# Altium project Main.PrjPCB
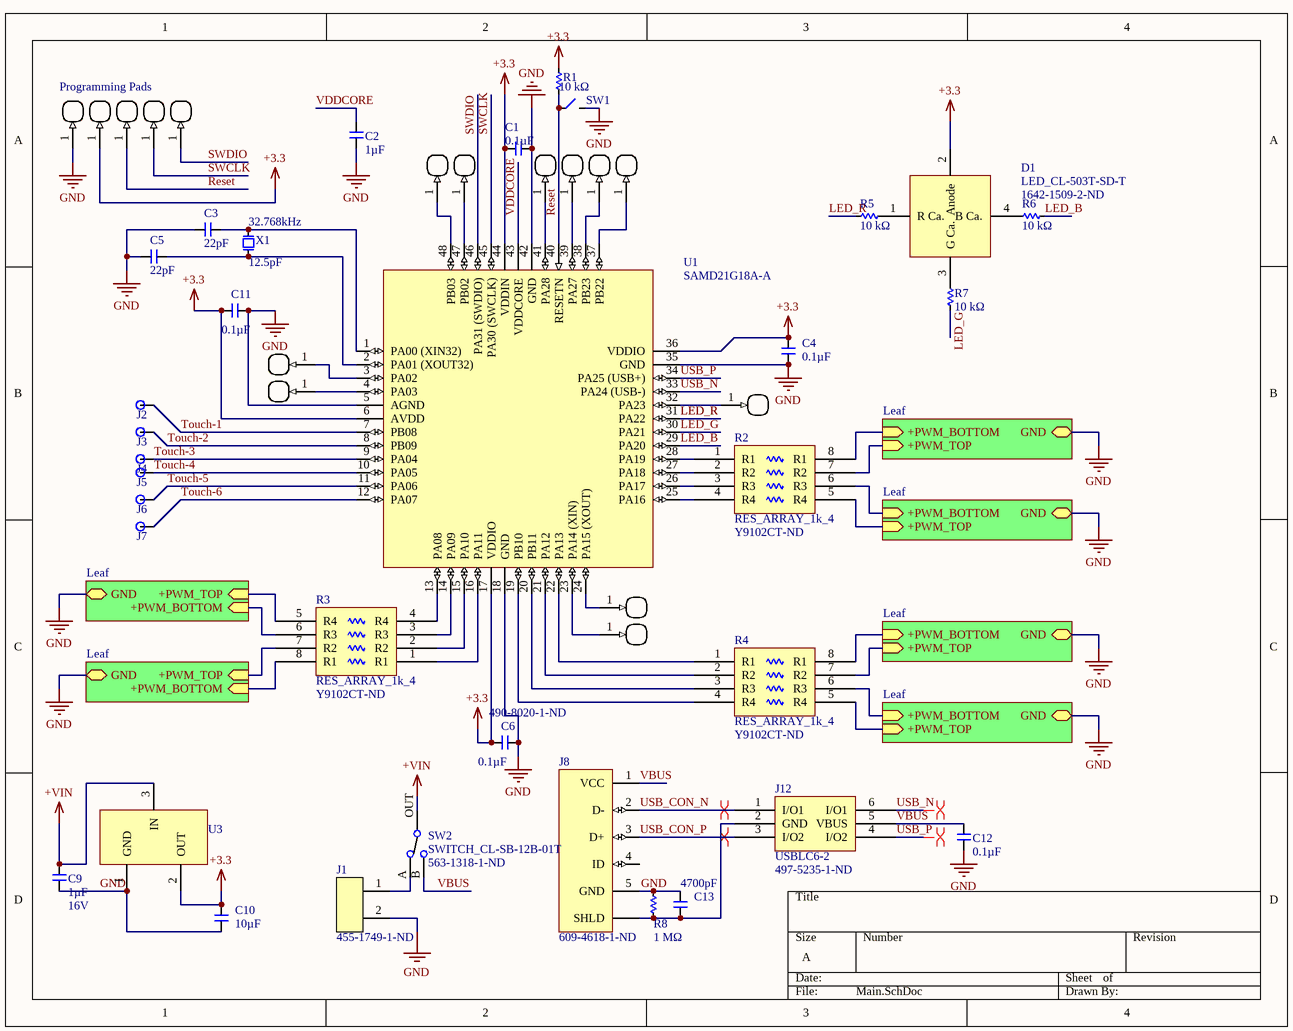
[diagram p0: Main.SchDoc]
3 sheets, 197 parts. Net scope: hierarchical (ports join the sheet entries above them; power ports are global).
Board file: Main_New.PcbDoc
Sheets:
  Main.SchDoc
    L1 = Leaf.SchDoc
    L1 = Leaf.SchDoc
    L1 = Leaf.SchDoc
    L1 = Leaf.SchDoc
    L1 = Leaf.SchDoc
    L1 = Leaf.SchDoc
  BMP388.SchDoc

## Sheet Main.SchDoc
size A

### Parts
C1  Capacitance (shorthand): 0.1µF  [C0603]  (hidden comment: __template_cap)
C2  Capacitance (shorthand): 1µF  [C0603]  (hidden comment: __template_cap)
C3  Capacitance (shorthand): 22pF  [C0603]  (hidden comment: __template_cap)
C4  Capacitance (shorthand): 0.1µF  [C0603]  (hidden comment: __template_cap)
C5  Capacitance (shorthand): 22pF  [C0603]  (hidden comment: __template_cap)
C6  Capacitance (shorthand): 0.1µF  Supplier Part Number 2: 490-8020-1-ND  [C0603]  (hidden comment: __template_cap)
C9  Capacitance (shorthand): 1µF  Rated Voltage: 16V  [C0603]  (hidden comment: __template_cap)
C10  Capacitance (shorthand): 10µF  [C0603]  (hidden comment: __template_cap)
C11  Capacitance (shorthand): 0.1µF  [C0603]  (hidden comment: __template_cap)
C12  Capacitance (shorthand): 0.1µF  [C0603]  (hidden comment: __template_cap)
C13  Capacitance (shorthand): 4700pF  [C0603]  (hidden comment: __template_cap)
D1  LED_CL-503T-SD-T  Supplier Part Number 1: 1642-1509-2-ND  [LED_RGB_CL-503T-SD-T]
J1  Supplier Part Number 1: 455-1749-1-ND  [CONN_JST_PH_SM4_2PIN_RA]  (hidden comment: CONN JST 2POS SMD)
J2  CONN_1x1  [CONN_1x1_100MIL]  (value not drawn)
J3  CONN_1x1  [CONN_1x1_100MIL]  (value not drawn)
J4  CONN_1x1  [CONN_1x1_100MIL]  (value not drawn)
J5  CONN_1x1  [CONN_1x1_100MIL]  (value not drawn)
J6  CONN_1x1  [CONN_1x1_100MIL]  (value not drawn)
J7  CONN_1x1  [CONN_1x1_100MIL]  (value not drawn)
J8  Supplier Part Number 1: 609-4618-1-ND  [CONN_USBMICROB_10118194-0001LF]  (hidden comment: CONN_USB_MICROB_SMD_TH_R/A)
J12  USBLC6-2  Supplier Part Number 1: 497-5235-1-ND  [6SOT23]
PA02  EWOD_PAD  [EWOD-PAD-2MM]  (value not drawn)
PA03  EWOD_PAD  [EWOD-PAD-2MM]  (value not drawn)
PA14  EWOD_PAD  [EWOD-PAD-2MM]  (value not drawn)
PA15  EWOD_PAD  [EWOD-PAD-2MM]  (value not drawn)
PA23  EWOD_PAD  [EWOD-PAD-2MM]  (value not drawn)
PA27  EWOD_PAD  [EWOD-PAD-2MM]  (value not drawn)
PA28  EWOD_PAD  [EWOD-PAD-2MM]  (value not drawn)
PB02  EWOD_PAD  [EWOD-PAD-2MM]  (value not drawn)
PB03  EWOD_PAD  [EWOD-PAD-2MM]  (value not drawn)
PB22  EWOD_PAD  [EWOD-PAD-2MM]  (value not drawn)
PB23  EWOD_PAD  [EWOD-PAD-2MM]  (value not drawn)
PRG_3.3  EWOD_PAD  [EWOD-PAD-2MM]  (value not drawn)
PRG_GND  EWOD_PAD  [EWOD-PAD-2MM]  (value not drawn)
PRG_RST  EWOD_PAD  [EWOD-PAD-2MM]  (value not drawn)
PRG_SWCLK  EWOD_PAD  [EWOD-PAD-2MM]  (value not drawn)
PRG_SWDIO  EWOD_PAD  [EWOD-PAD-2MM]  (value not drawn)
R1  Resistance: 10 kΩ  [R0603]  (hidden comment: __template_resistor)
R2  RES_ARRAY_1k_4  Supplier Part Number 1: Y9102CT-ND  [RES_ARRAY_1k]
R3  RES_ARRAY_1k_4  Supplier Part Number 1: Y9102CT-ND  [RES_ARRAY_1k]
R4  RES_ARRAY_1k_4  Supplier Part Number 1: Y9102CT-ND  [RES_ARRAY_1k]
R5  Resistance: 10 kΩ  [R0603]  (hidden comment: __template_resistor)
R6  Resistance: 10 kΩ  [R0603]  (hidden comment: __template_resistor)
R7  Resistance: 10 kΩ  [R0603]  (hidden comment: __template_resistor)
R8  Resistance: 1 MΩ  [R0603]  (hidden comment: __template_resistor)
SW1  SWITCH_SPST-NO  [SWITCH_B3U-1000P]  (value not drawn)
SW2  SWITCH_CL-SB-12B-01T  Supplier Part Number 1: 563-1318-1-ND  [SWITCH_CL-SB-12B-01T]
U1  SAMD21G18A-A  [SAMD21 TQFP-48]
U3  LDO_AP2210N-3.3TRG1  [3SOT23]  (value not drawn)
X1  Frequency: 32.768kHz  Load Capacitance: 12.5pF  [XTAL_TXC_9HT10]  (hidden comment: XTAL_9HT10-32.768KEZF-T)

### Sub-sheets
L1 = Leaf: GND (bidir), +PWM_TOP (in), +PWM_BOTTOM (in)
L1 = Leaf: GND (bidir), +PWM_TOP (in), +PWM_BOTTOM (in)
L1 = Leaf: GND (bidir), +PWM_TOP (in), +PWM_BOTTOM (in)
L1 = Leaf: GND (bidir), +PWM_TOP (in), +PWM_BOTTOM (in)
L1 = Leaf: GND (bidir), +PWM_TOP (in), +PWM_BOTTOM (in)
L1 = Leaf: GND (bidir), +PWM_TOP (in), +PWM_BOTTOM (in)

### Nets
+3.3: C1.2 C4.2 C6.1 C10.1 C11.1 D1.2(Anode) PRG_3.3.1 R1.2 U1.6(AVDD) U1.17(VDDIO) U1.36(VDDIO) U1.44(VDDIN) U3.2(OUT)
+PWM_BOTTOM: R2.6(R3) R2.8(R1) R3.6(R3) R3.8(R1) R4.6(R3) R4.8(R1) ; sheet L1/+PWM_BOTTOM, sheet L1/+PWM_BOTTOM, sheet L1/+PWM_BOTTOM, sheet L1/+PWM_BOTTOM, sheet L1/+PWM_BOTTOM, sheet L1/+PWM_BOTTOM
+PWM_TOP: R2.5(R4) R2.7(R2) R3.5(R4) R3.7(R2) R4.5(R4) R4.7(R2) ; sheet L1/+PWM_TOP, sheet L1/+PWM_TOP, sheet L1/+PWM_TOP, sheet L1/+PWM_TOP, sheet L1/+PWM_TOP, sheet L1/+PWM_TOP
+VIN: C9.1 SW2.OUT U3.3(IN)
GND: C1.1 C2.2 C3.1 C4.1 C5.1 C6.2 C9.2 C10.2 C11.2 C12.2 C13.1 J1.2 J8.5(GND) PRG_GND.1 R8.2 SW1.2 U1.5(AGND) U1.18(GND) U1.35(GND) U1.42(GND) U3.1(GND) ; sheet L1/GND, sheet L1/GND, sheet L1/GND, sheet L1/GND, sheet L1/GND, sheet L1/GND
LED_B: R6.2 U1.29(PA20)
LED_G: R7.1 U1.30(PA21)
LED_R: R5.2 U1.31(PA22)
Reset: PRG_RST.1 R1.1 SW1.1 U1.40(RESETN)
SWCLK: PRG_SWCLK.1 U1.45(PA30_(SWCLK))
SWDIO: PRG_SWDIO.1 U1.46(PA31_(SWDIO))
Touch-1: J2.1 U1.7(PB08)
Touch-2: J3.1 U1.8(PB09)
Touch-3: J4.1 U1.9(PA04)
Touch-4: J5.1 U1.10(PA05)
Touch-5: J6.1 U1.11(PA06)
Touch-6: J7.1 U1.12(PA07)
USB_CON_N: J8.2(D-) J12.1(I/O1)
USB_CON_P: J8.3(D+) J12.3(I/O2)
USB_N: J12.6(I/O1) U1.33(PA24_(USB-))
USB_P: J12.4(I/O2) U1.34(PA25_(USB+))
VBUS: C12.1 J8.1(VCC) J12.5(VBUS) SW2.B
VDDCORE: C2.1 U1.43(VDDCORE)
NetC3_2: C3.2 U1.1(PA00_(XIN32)) X1.2
NetC5_2: C5.2 U1.2(PA01_(XOUT32)) X1.1
NetC13_2: C13.2 J8.SHIELD(SHLD) J12.2(GND) R8.1
NetD1_1: D1.1(R_Ca.) R5.1
NetD1_3: D1.3(G_Ca.) R7.2
NetD1_4: D1.4(B_Ca.) R6.1
NetJ1_1: J1.1 SW2.A
NetPA02_1: PA02.1 U1.3(PA02)
NetPA03_1: PA03.1 U1.4(PA03)
NetPA14_1: PA14.1 U1.23(PA14_(XIN))
NetPA15_1: PA15.1 U1.24(PA15_(XOUT))
NetPA23_1: PA23.1 U1.32(PA23)
NetPA27_1: PA27.1 U1.39(PA27)
NetPA28_1: PA28.1 U1.41(PA28)
NetPB02_1: PB02.1 U1.47(PB02)
NetPB03_1: PB03.1 U1.48(PB03)
NetPB22_1: PB22.1 U1.37(PB22)
NetPB23_1: PB23.1 U1.38(PB23)
NetR2_1: R2.1(R1) U1.28(PA19)
NetR2_2: R2.2(R2) U1.27(PA18)
NetR2_3: R2.3(R3) U1.26(PA17)
NetR2_4: R2.4(R4) U1.25(PA16)
NetR3_1: R3.1(R1) U1.16(PA11)
NetR3_2: R3.2(R2) U1.15(PA10)
NetR3_3: R3.3(R3) U1.14(PA09)
NetR3_4: R3.4(R4) U1.13(PA08)
NetR4_1: R4.1(R1) U1.22(PA13)
NetR4_2: R4.2(R2) U1.21(PA12)
NetR4_3: R4.3(R3) U1.20(PB11)
NetR4_4: R4.4(R4) U1.19(PB10)

Not connected (* = marked no-connect by the designer): J8 4(ID)

### Layout directives
differential pair: USB_CON_N, USB_CON_P, USB_N, USB_P

### Notes on the sheet
- Programming Pads

### Library data of the parts
C1 C4 C6 C11 C12 = CAP CER 0603 0.1µF X7R 50V 10%: Manufacturer: Murata Electronics North America; Capacitance - pF (Machine readable): 100000; type: capacitor; Dielectric: X7R; Supplier 1: Digikey
  C1 C4 C11: Supplier Part Number 1: 478-5052-1-ND; Supplier 2: Digi-Key; Supplier Part Number 2: 490-8020-1-ND
  C6: Supplier Part Number 1: 478-5052-1-ND; Supplier 2: Digi-Key
  C12: Supplier Part Number 1: 490-1519-1-ND
C2 = CAP CER 0603 1µF X7R 16V 10%: Manufacturer: Murata Electronics North America; Capacitance - pF (Machine readable): 1000000; TYPE: Capacitor; Dielectric: X7R; Supplier 1: Digi-Key; Supplier Part Number 1: 490-10479-1-ND
C3 C5 = CAP CER 22PF 50V C0G/NP0 0603: Supplier 1: Digi-Key; Supplier Part Number 1: 478-5771-1-ND
C9 = CAP CER 0603 1µF X7R 16V 10%: Manufacturer: Murata Electronics North America; Capacitance - pF (Machine readable): 1000000; type: capacitor; Dielectric: X7R; Supplier 1: Digikey; Supplier Part Number 1: 490-3900-1-ND
C10 = CAP CER 10UF 35V X5R 0603 20%: Manufacturer: Murata Electronics North America; Capacitance - pF (Machine readable): 10000000; type: capacitor; Dielectric: X5R; Supplier 1: Digikey; Supplier Part Number 1: 490-13248-1-ND
C13 = CAP CER 0603 4700pF X7R 50V 10%: Manufacturer: Murata Electronics North America; Capacitance - pF (Machine readable): 4700; type: capacitor; Dielectric: X7R; Supplier 1: Digikey; Supplier Part Number 1: 490-1506-1-ND
D1 = LED_CL-503T-SD-T: RGB LOW VOLTAGE RICOLOR TOP FIRING 1.5 X 1.3 X; Manufacturer: Citizen; Color: Red, Green, Blue (RGB); Configuration: Common Anode; Millicandela Rating: 36mcd Red, 180mcd Green, 40mcd Blue; Lens Style/Size: Rectangle with Flat Top, 1.30mm x 1.50mm; Voltage - Forward (Vf) (Typ): 1.85V Red, 2.7V Green, 2.75V Blue; Current - Test: 5mA Red, 5mA Green, 5mA Blue; Wavelength - Peak: 618nm Red, 530nm Green, 470nm Blue; Supplier 1: Digi-Key; Manufacturer Part Number: CL-503T-SD-T; RoHS: RoHS Compliant; Category: Optoelectronics; Stock 1: 15000; Pricing 1: 5000=0.2318, 10000=0.22836, 25000=0.22321 (USD); Packaging: Tape & Reel (TR); Part Status: Active; Lens Color: -; Lens Transparency: -; Viewing Angle: -; Mounting Type: Surface Mount; Wavelength - Dominant: -; Features: -; Package / Case: 4-SMD, No Lead; Supplier Device Package: -; Size / Dimension: 1.50mm L x 1.30mm W; Height (Max): 0.35mm; ComponentLink1URL: http://ce.citizen.co.jp/up_img/product/KF9Gun57LXzH/CL-503_e.pdf; ComponentLink1Description: http://ce.citizen.co.jp/up_img/product/KF9Gun57LXzH/CL-503_e.pdf
J1 = CONN_JST_2_PH: CONN HEADER PH SIDE 2POS 2MM SMD; Manufacturer: JST Sales America Inc.; Manufacturer Part Number: S2B-PH-SM4-TB(LF)(SN); Connector Type: Header, Shrouded; Number of Positions: 2; Number of Positions Loaded: All; Pitch: 0.079" (2.00mm); Supplier 1: Digi-Key; RoHS: RoHS Compliant; Category: Connectors, Interconnects; Stock 1: 148568; Pricing 1: 1=0.56, 10=0.521, 25=0.4688, 50=0.4168, 100=0.3994, 250=0.36472, 500=0.34734 (USD); Packaging: Cut Tape (CT); Contact Type: Male Pin; Number of Rows: 1; Row Spacing: -; Contact Mating Length: 0.130" (3.30mm); Mounting Type: Surface Mount, Right Angle; Termination: Solder; Fastening Type: Detent Lock; Features: Solder Retention; Contact Finish: Tin; Contact Finish Thickness: -; Color: Natural; ComponentLink1URL: http://www.jst-mfg.com/product/pdf/eng/ePH.pdf; ComponentLink1Description: http://www.jst-mfg.com/product/pdf/eng/ePH.pdf
J2-J7 = CONN_1x1: Just a hole, lol
J8 = CONN_USB_MICROB_SMD_TH_R/A: Through Hole Micro USB Connector; Manufacturer: Amphenol FCI; Manufacturer Part Number: 10118194-0001LF; Gender: Receptacle; Current Rating: 1.8A; Connector Type: USB,Receptacle; Number of Contacts: 5; Insulation Resistance: 1GR; Number of Ports: 1; Max Voltage Rating (AC): 100V; Pitch: 0.65mm; Supplier 1: Digi-Key; Stock 1: 180464; Pricing 1: 1=0.46, 10=0.437, 25=0.3744, 50=0.318, 100=0.3056, 250=0.2744, 500=0.262 (USD); Mount: Surface Mount,Horizontal; Contact Material: Copper Alloy; Contact Plating: Nickel,Gold; Number of Terminals: 5; Housing Material: Polymer; Colour: Black; Min Operating Temperature: -55°C; Max Operating Temperature: 85°C; Package Quantity: 9600; Packaging: Tape and Reel; Termination: Solder; Orientation: Right Angle; Length: 8.05mm; Depth: 5mm; Radiation Hardening: No; Lead Free: Lead Free; Flammability Rating: UL94 V-0; ComponentLink1URL: https://datasheet.ciiva.com/851/10118194-851110.pdf; ComponentLink1Description: https://datasheet.ciiva.com/851/10118194-851110.pdf; ComponentLink2URL: https://datasheet.ciiva.com/851/10118194-851111.pdf; ComponentLink2Description: https://datasheet.ciiva.com/851/10118194-851111.pdf; ComponentLink3URL: https://datasheet.ciiva.com/4598/10118194ac-197217-4598807.pdf; ComponentLink3Description: https://datasheet.ciiva.com/4598/10118194ac-197217-4598807.pdf; ComponentLink4URL: https://datasheet.ciiva.com/29907/10118194-29907230.pdf; ComponentLink4Description: https://datasheet.ciiva.com/29907/10118194-29907230.pdf; ComponentLink5URL: https://datasheet.ciiva.com/26945/getdatasheetpartid-418619-26945695.pdf; ComponentLink5Description: https://datasheet.ciiva.com/26945/getdatasheetpartid-418619-26945695.pdf
J12 = USBLC6-2: Manufacturer: STMicroelectronics; Manufacturer Part Number: USBLC6-2SC6; Unidirectional Channels: 2; Voltage - Reverse Standoff (Typ): 5.25V; Voltage - Breakdown (Min): 6V; Voltage - Clamping (Max) @ Ipp: 17V; Current - Peak Pulse (10/1000µs): 5A (8/20µs); Power Line Protection: Yes; Supplier 1: Digi-Key; RoHS: RoHS Compliant; Category: Circuit Protection; Stock 1: 31719; Pricing 1: 1=0.51, 10=0.411, 100=0.2802, 500=0.21012, 1000=0.15759 (USD); Packaging: Cut Tape (CT); Part Status: Active; Type: Steering (Rail to Rail); Bidirectional Channels: -; Power - Peak Pulse: -; Applications: Ethernet; Capacitance @ Frequency: -; Operating Temperature: -40°C ~ 125°C (TJ); Mounting Type: Surface Mount; Package / Case: SOT-23-6; Supplier Device Package: SOT-23-6; ComponentLink1URL: http://www.st.com/web/en/resource/technical/document/datasheet/CD00050750.pdf; ComponentLink1Description: http://www.st.com/web/en/resource/technical/document/datasheet/CD00050750.pdf
R1 R5-R7 = RES SMD 10K OHM 1% 1/10W 0603: Manufacturer Part Number: RC0603FR-0710KL; Manufacturer: Yageo; Resistance (Sortable): 10000; Tolerance: ±1%; Power (Watts): 0.1W, 1/10W; Temperature Coefficient: ±100ppm/°C; Supplier 1: Digikey; Datasheets: http://www.yageo.com/documents/recent/PYu-RC_Group_51_RoHS_L_9.pdf; Image: //media.digikey.com/Renders/Yageo%20Renders/0603-(1608-Metric).jpg; Operating Temperature: -55°C ~ 155°C
  R1: Supplier Part Number 1: 541-1784-1-ND
  R5-R7: Supplier Part Number 1: 311-10.0KHRCT-ND
R2-R4 = RES_ARRAY_1k_4: RES ARRAY 4 RES 1K OHM 1206; Supplier 1: Digi-Key
R8 = RES SMD 1M OHM 1% 1/10W 0603: Manufacturer Part Number: RC0603FR-071ML; Manufacturer: Yageo; Resistance (Sortable): 1000000; Tolerance: ±1%; Power (Watts): 0.1W, 1/10W; Temperature Coefficient: ±100ppm/°C; Supplier 1: Digikey; Datasheets: http://www.yageo.com/documents/recent/PYu-RC_Group_51_RoHS_L_9.pdf; Image: //media.digikey.com/Renders/Yageo%20Renders/0603-(1608-Metric).jpg; Supplier Part Number 1: 311-1.00MHRCT-ND; Operating Temperature: -55°C ~ 155°C
SW1 = SWITCH_SPST-NO: SWITCH TACTILE SPST-NO 0.05A 12V; Manufacturer: Omron Electronics Inc-EMC Div; Manufacturer Part Number: B3U-1000P; Switch Function: Off-Mom; Actuator Type: Standard; Actuator Height off PCB, from Pins: 1.60mm; Actuator Orientation: Top Actuated; Outline: 3.00mm x 2.50mm; Illumination: Non-Illuminated; Operating Force: 153gf; Ingress Protection: Dust Proof; Switch Travel: 0.15mm; Mechanical Life: 200,000 Cycles; Contact Rating @ Voltage: 0.05A @ 12VDC; Supplier 1: Digi-Key; RoHS: RoHS Compliant; Category: Switches; Stock 1: 16437; Pricing 1: 1=1.25, 10=1.201, 25=1.1332, 50=0.997, 100=0.9064, 250=0.86108, 500=0.83842, 1000=0.65714 (USD); Circuit: SPST-NO; Mounting Type: Surface Mount; Termination Style: SMD (SMT) Tab; Illumination Voltage (Nominal): -; Illumination Type, Color: -; Features: -; Packaging: Cut Tape (CT); Actuator Material: -; Operating Temperature: -25°C ~ 70°C; ComponentLink1URL: http://components.omron.com/components/web/pdflib.nsf/0/2DD3893C7DD33E9E862572900079E9D6/$file/B3U_1110.pdf; ComponentLink1Description: http://components.omron.com/components/web/pdflib.nsf/0/2DD3893C7DD33E9E862572900079E9D6/$file/B3U_1110.pdf; Supplier Part Number 1: SW1020CT-ND
SW2 = SWITCH_CL-SB-12B-01T: Manufacturer: Copal Electronics Inc.; Circuit: SPDT; Contact Timing: Non-Shorting (BBM); Switch Function: On-On; Current Rating: 200mA (DC); Voltage Rating - DC: 12V; Actuator Type: Standard; Actuator Length: 2.00mm; Actuator Material: Polyamide (PA), Nylon; Electrical Life: 10,000 Cycles; Operating Force: 153gf; Supplier 1: Digi-Key; Manufacturer Part Number: CL-SB-12B-01T; RoHS: RoHS Compliant; Category: Switches; Stock 1: 24034; Pricing 1: 1=0.89, 10=0.853, 25=0.8356, 50=0.7466, 100=0.711, 250=0.69328 (USD); Packaging: Cut Tape (CT); Part Status: Active; Voltage Rating - AC: -; Contact Material: Copper; Contact Finish: Silver; Mounting Type: Surface Mount; Termination Style: Gull Wing; Features: -; Switch Travel: 2.00mm; Operating Temperature: -40°C ~ 85°C; Mechanical Life: -; ComponentLink1URL: http://www.nidec-copal-electronics.com/e/catalog/switch/cl-sb.pdf; ComponentLink1Description: http://www.nidec-copal-electronics.com/e/catalog/switch/cl-sb.pdf
U1 = SAMD21G18A-A: 48Mhz Atmel SAM ARM Cortex M0+; ComponentLink1Description: Product Page; ComponentLink1URL: https://www.microchip.com/wwwproducts/en/ATSAMD21G18; ComponentLink2Description: Datasheet; ComponentLink2URL: http://ww1.microchip.com/downloads/en/DeviceDoc/SAM-D21-Family-Datasheet-DS40001882C.pdf; Supplier 1: Digi-Key; Supplier Part Number 1: ATSAMD21G18A-AU-ND
U3 = LDO_AP2210N-3.3TRG1: IC REG LINEAR 3.3V 300MA SOT23-3; Manufacturer: Diodes; Dropout Voltage: 250mV; Number of Outputs: 1; Min Input Voltage: 2.5V; Max Input Voltage: 13.2V; Polarity: Positive; Quiescent Current: 150uA; Accuracy: 1%; Power Supply Rejection Ratio (PSRR): 75dB; Supplier 1: Digi-Key; Manufacturer Part Number: AP2210N-3.3TRG1; Stock 1: 36056; Pricing 1: 1=0.42, 10=0.317, 100=0.1973, 500=0.135, 1000=0.1038 (USD); Mount: Surface Mount; Case/Package: TO-236-3; Number of Pins: 3; Weight: 0.000282oz; Min Operating Temperature: -40°C; Max Operating Temperature: 125°C; Package Quantity: 3000; Packaging: Tape and Reel; Max Output Current: 300mA; Output Voltage: 3.3V; Output Current: 300mA; Number of Regulators: 1; Length: 3.02mm; Height: 1.3mm; Width: 1.7mm; ComponentLink1URL: https://datasheet.ciiva.com/29569/ap2210-29569040.pdf; ComponentLink1Description: https://datasheet.ciiva.com/29569/ap2210-29569040.pdf; Supplier Part Number 1: AP2210N-3.3TRG1DICT-ND
X1 = XTAL_9HT10-32.768KEZF-T: CRYSTAL 32.768 KHZ 12.5 PF SMD; Manufacturer: TXC CORPORATION; Frequency Tolerance: ±10ppm; ESR (Equivalent Series Resistance): 70 kOhm; Operating Mode: Fundamental; Supplier 1: Digi-Key; Manufacturer Part Number: 9HT10-32.768KEZF-T; RoHS: RoHS Compliant; Category: Crystals and Oscillators; Stock 1: 5250; Pricing 1: 1=1.88, 10=1.625, 50=1.425, 100=1.125, 500=0.95, 1000=0.75 (USD); Type: kHz Crystal (Tuning Fork); Frequency Stability: -; Operating Temperature: -40°C ~ 85°C; Ratings: -; Mounting Type: Surface Mount; Package / Case: 2-SMD; Size / Dimension: 0.126" L x 0.059" W (3.20mm x 1.50mm); Height: 0.033" (0.85mm); Packaging: Cut Tape (CT); ComponentLink1URL: http://www.txccrystal.com/images/pdf/9ht10.pdf; ComponentLink1Description: Datasheet; Supplier Part Number 1: 887-1507-1-ND

## Sheet Leaf.SchDoc
size A
Used 6 times, as channels L1, L1, L1, L1, L1, L1. Parts and nets are listed once, with the designators drawn on the sheet.
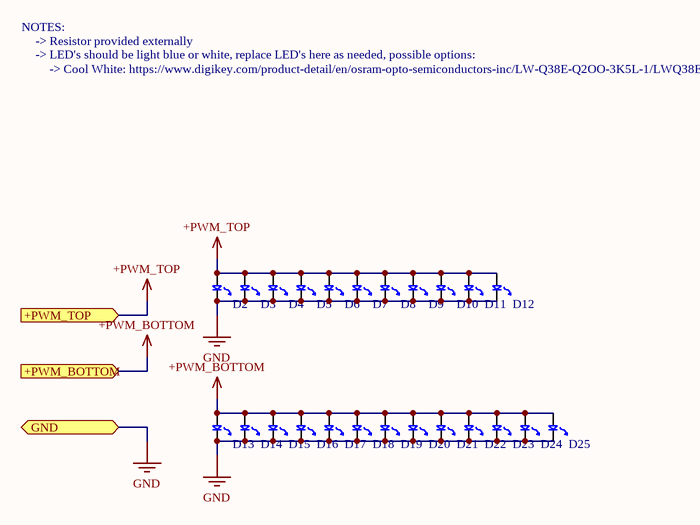
[diagram p1: Leaf.SchDoc]

### Parts
D2  LED_LBQ39G_BLUE  [LED_0603P_BLUE]  (value not drawn)
D3  LED_LBQ39G_BLUE  [LED_0603P_BLUE]  (value not drawn)
D4  LED_LBQ39G_BLUE  [LED_0603P_BLUE]  (value not drawn)
D5  LED_LBQ39G_BLUE  [LED_0603P_BLUE]  (value not drawn)
D6  LED_LBQ39G_BLUE  [LED_0603P_BLUE]  (value not drawn)
D7  LED_LBQ39G_BLUE  [LED_0603P_BLUE]  (value not drawn)
D8  LED_LBQ39G_BLUE  [LED_0603P_BLUE]  (value not drawn)
D9  LED_LBQ39G_BLUE  [LED_0603P_BLUE]  (value not drawn)
D10  LED_LBQ39G_BLUE  [LED_0603P_BLUE]  (value not drawn)
D11  LED_LBQ39G_BLUE  [LED_0603P_BLUE]  (value not drawn)
D12  LED_LBQ39G_BLUE  [LED_0603P_BLUE]  (value not drawn)
D13  LED_LBQ39G_BLUE  [LED_0603P_BLUE]  (value not drawn)
D14  LED_LBQ39G_BLUE  [LED_0603P_BLUE]  (value not drawn)
D15  LED_LBQ39G_BLUE  [LED_0603P_BLUE]  (value not drawn)
D16  LED_LBQ39G_BLUE  [LED_0603P_BLUE]  (value not drawn)
D17  LED_LBQ39G_BLUE  [LED_0603P_BLUE]  (value not drawn)
D18  LED_LBQ39G_BLUE  [LED_0603P_BLUE]  (value not drawn)
D19  LED_LBQ39G_BLUE  [LED_0603P_BLUE]  (value not drawn)
D20  LED_LBQ39G_BLUE  [LED_0603P_BLUE]  (value not drawn)
D21  LED_LBQ39G_BLUE  [LED_0603P_BLUE]  (value not drawn)
D22  LED_LBQ39G_BLUE  [LED_0603P_BLUE]  (value not drawn)
D23  LED_LBQ39G_BLUE  [LED_0603P_BLUE]  (value not drawn)
D24  LED_LBQ39G_BLUE  [LED_0603P_BLUE]  (value not drawn)
D25  LED_LBQ39G_BLUE  [LED_0603P_BLUE]  (value not drawn)

### Ports
+PWM_BOTTOM (in), +PWM_TOP (in), GND (bidir)

### Nets
+PWM_BOTTOM: D13.2 D14.2 D15.2 D16.2 D17.2 D18.2 D19.2 D20.2 D21.2 D22.2 D23.2 D24.2 D25.2 ; port +PWM_BOTTOM
+PWM_TOP: D2.2 D3.2 D4.2 D5.2 D6.2 D7.2 D8.2 D9.2 D10.2 D11.2 D12.2 ; port +PWM_TOP
GND: D2.1 D3.1 D4.1 D5.1 D6.1 D7.1 D8.1 D9.1 D10.1 D11.1 D12.1 D13.1 D14.1 D15.1 D16.1 D17.1 D18.1 D19.1 D20.1 D21.1 D22.1 D23.1 D24.1 D25.1 ; port GND

### Channels
L1: designators end in _L1#1; ports +PWM_BOTTOM=+PWM_BOTTOM +PWM_TOP=+PWM_TOP GND=GND
L1: designators end in _L1#2; ports +PWM_BOTTOM=+PWM_BOTTOM +PWM_TOP=+PWM_TOP GND=GND
L1: designators end in _L1#3; ports +PWM_BOTTOM=+PWM_BOTTOM +PWM_TOP=+PWM_TOP GND=GND
L1: designators end in _L1#4; ports +PWM_BOTTOM=+PWM_BOTTOM +PWM_TOP=+PWM_TOP GND=GND
L1: designators end in _L1#5; ports +PWM_BOTTOM=+PWM_BOTTOM +PWM_TOP=+PWM_TOP GND=GND
L1: designators end in _L1#6; ports +PWM_BOTTOM=+PWM_BOTTOM +PWM_TOP=+PWM_TOP GND=GND

### Notes on the sheet
- NOTES:
- -> Resistor provided externally
- -> LED's should be light blue or white, replace LED's here as needed, possible options:
- -> Cool White: https://www.digikey.com/product-detail/en/osram-opto-semiconductors-inc/LW-Q38E-Q2OO-3K5L-1/LWQ38E-Q2OO-3K5L-1-ND/2205739

### Library data of the parts
D2-D25 = LED_LBQ39G_BLUE: Blue 470nm LED Indication - Discrete 2.85V 0603 (1608 Metric); Manufacturer: OSRAM Opto Semiconductors Inc.; Manufacturer Part Number: LB Q39G-L2OO-35-1; Lens Color: White; Lens Transparency: Diffused; Millicandela Rating: 29.5mcd; Lens Style/Size: Rectangle with Flat Top, 1.10mm x 0.80mm; Current - Test: 5mA; Viewing Angle: 155°, 135°; Wavelength - Peak: 472nm; Supplier 1: Digi-Key; RoHS: RoHS Compliant; Category: Optoelectronics; Stock 1: 57960; Pricing 1: 1=0.35, 10=0.25, 25=0.2172, 100=0.167, 250=0.13568, 500=0.10018, 1000=0.08349 (USD); Packaging: Cut Tape (CT); Color: Blue; Voltage - Forward (Vf) (Typ): 2.85V; Mounting Type: Surface Mount; Wavelength - Dominant: 470nm; Features: -; Package / Case: 0603 (1608 Metric); Supplier Device Package: *; Size / Dimension: 1.60mm L x 0.80mm W; Height (Max): 0.40mm; ComponentLink1URL: http://media.digikey.com/pdf/Data%20Sheets/Osram%20PDFs/LB_LT%20Q39G.pdf; ComponentLink1Description: http://media.digikey.com/pdf/Data%20Sheets/Osram%20PDFs/LB_LT%20Q39G.pdf; Supplier Part Number 1: 475-2816-1-ND

## Sheet BMP388.SchDoc
size A
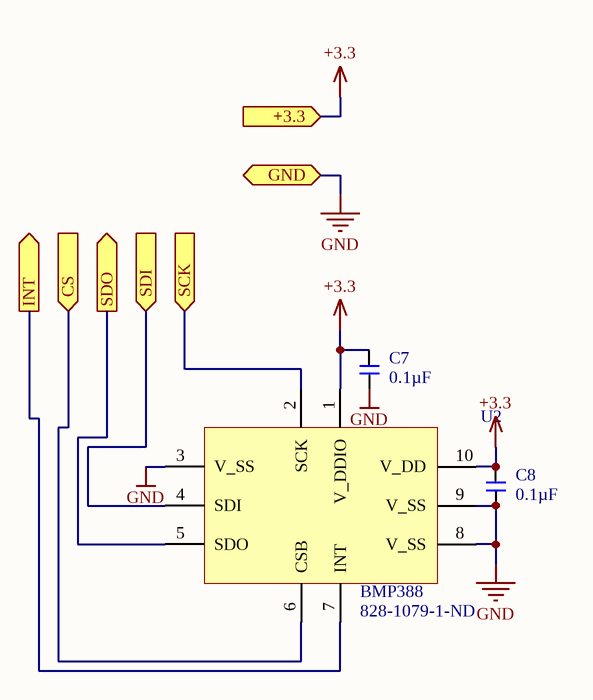
[diagram p2: BMP388.SchDoc]

### Parts
C7  Capacitance (shorthand): 0.1µF  [C0603]  (hidden comment: __template_cap)
C8  Capacitance (shorthand): 0.1µF  [C0603]  (hidden comment: __template_cap)
U2  BMP388  Supplier Part Number 1: 828-1079-1-ND  [8 pin LGA]

### Ports
+3.3 (in), CS (in), GND (bidir), INT (out), SCK (in), SDI (in), SDO (out)

### Nets
+3.3: C7.2 C8.2 U2.1(V_DDIO) U2.10(V_DD) ; port +3.3
GND: C7.1 C8.1 U2.3(V_SS) U2.8(V_SS) U2.9(V_SS) ; port GND
NetU2_2: U2.2(SCK) ; port SCK
NetU2_4: U2.4(SDI) ; port SDI
NetU2_5: U2.5(SDO) ; port SDO
NetU2_6: U2.6(CSB) ; port CS
NetU2_7: U2.7(INT) ; port INT

### Library data of the parts
C7 C8 = CAP CER 0603 0.1µF X7R 50V 10%: as C1 on sheet Main; Supplier 1: Digikey; Supplier Part Number 1: 478-5052-1-ND; Supplier 2: Digi-Key; Supplier Part Number 2: 490-8020-1-ND
U2 = BMP388: Pressure Sensor 4.35 PSI ~ 18.13 PSI (30 kPa ~ 125 kPa) Absolute 10-WFLGA; Manufacturer: Bosch Sensortec; Supplier 1: Digi-Key; Manufacturer Part Number: BMP388; Stock 1: 46050; Pricing 1: 1=3.93, 5=3.466, 10=3.061, 25=2.4832, 50=2.1946, 100=2.1368, 500=1.7903, 1000=1.6748, 5000=1.5593 (USD); ComponentLink1URL: https://ae-bst.resource.bosch.com/media/_tech/media/product_flyer/BST-BMP388-FL000-00.pdf; ComponentLink1Description: https://ae-bst.resource.bosch.com/media/_tech/media/product_flyer/BST-BMP388-FL000-00.pdf

## Nets that join several sheets
+3.3: Main (13 pins), BMP388 (C7.2 C8.2 U2.1 U2.10)
+PWM_BOTTOM: Main (6 pins), L1 (13 pins), L1 (13 pins), L1 (13 pins), L1 (13 pins), L1 (13 pins), L1 (13 pins)
+PWM_TOP: Main (6 pins), L1 (11 pins), L1 (11 pins), L1 (11 pins), L1 (11 pins), L1 (11 pins), L1 (11 pins)
GND: Main (21 pins), L1 (24 pins), L1 (24 pins), L1 (24 pins), L1 (24 pins), L1 (24 pins), L1 (24 pins), BMP388 (5 pins)